# EAGLE design 0_3cbrd (EAGLE 7.6.0)
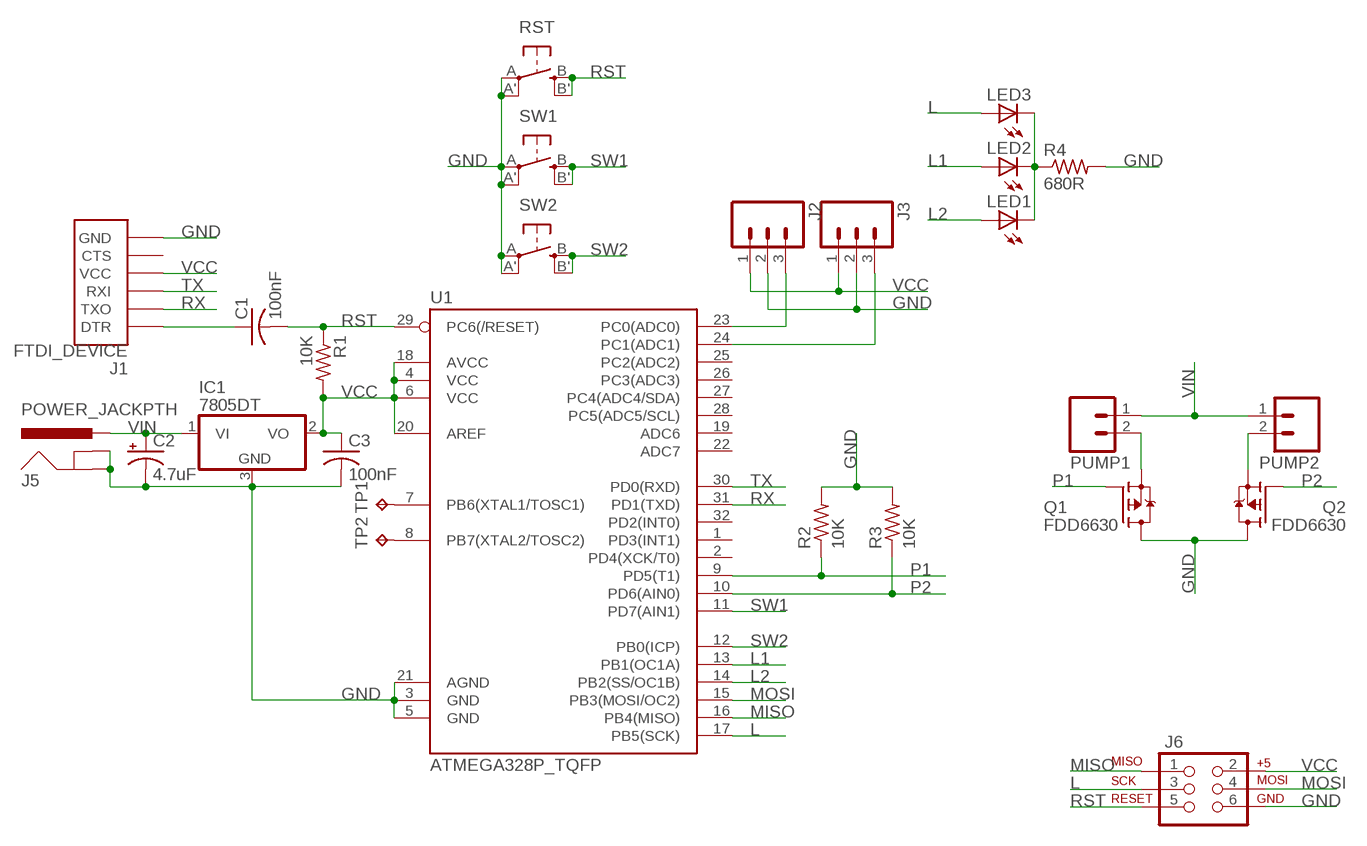
[diagram p0: schematic, sheet 1]

## Parts
C1  100nF  C-USC1206K  [C1206K]
C2  4.7uF  CPOL-US153CLV-0405  [153CLV-0405]
C3  100nF  C-USC1206K  [C1206K]
IC1  7805DT  [TO252]
J1  FTDI_DEVICE  [FTDI_DEVICE_SIDE]
J2  M03PTH  [1X03]
J3  M03PTH  [1X03]
J5  POWER_JACKPTH  [POWER_JACK_PTH]
J6  AVR_SPI_PRG_6PTH  [2X3]
LED1  LED3MM  [LED3MM]
LED2  LED3MM  [LED3MM]
LED3  LED3MM  [LED3MM]
PUMP1  M02PTH  [1X02]
PUMP2  M02PTH  [1X02]
Q1  FDD6630  FDD4141TO252  [TO252]
Q2  FDD6630  FDD4141TO252  [TO252]
R1  10K  R-US_M0805  [M0805]
R2  10K  R-US_M0805  [M0805]
R3  10K  R-US_M0805  [M0805]
R4  680R  R-US_M0805  [M0805]
RST  SPST_TACT-EVQQ2  [EVQ-Q2]
SW1  SPST_TACT-EVQQ2  [EVQ-Q2]
SW2  SPST_TACT-EVQQ2  [EVQ-Q2]
TP1  TPTP15SQ  [TP15SQ]
TP2  TPTP15SQ  [TP15SQ]
U1  ATMEGA328P_TQFP  [TQFP32-08]

## Nets
GND: C2.- C3.2 IC1.3(GND) J1.P$6(GND) J2.2 J3.2 J5.GND J5.GNDBREAK J6.6 Q1.3(D) Q2.3(D) R2.2 R3.2 R4.2 RST.A'(P1) RST.A(P) SW1.A'(P1) SW1.A(P) SW2.A'(P1) SW2.A(P) U1.3(GND) U1.5(GND) U1.21(AGND)
L: J6.3 LED3.A U1.17(PB5(SCK))
L1: LED2.A U1.13(PB1(OC1A))
L2: LED1.A U1.14(PB2(SS/OC1B))
MISO: J6.1 U1.16(PB4(MISO))
MOSI: J6.4 U1.15(PB3(MOSI/OC2))
N$1: LED1.K(C) LED2.K(C) LED3.K(C) R4.1
N$2: TP1.TP U1.7(PB6(XTAL1/TOSC1))
N$3: PUMP1.2 Q1.2(S)
N$4: C1.1 J1.P$1(DTR)
N$5: TP2.TP U1.8(PB7(XTAL2/TOSC2))
N$9: J2.3 U1.23(PC0(ADC0))
N$10: J3.3 U1.24(PC1(ADC1))
N$25: PUMP2.2 Q2.2(S)
P1: Q1.1(G) R2.1 U1.9(PD5(T1))
P2: Q2.1(G) R3.1 U1.10(PD6(AIN0))
RST: C1.2 J6.5 R1.1 RST.B'(S1) RST.B(S) U1.29(PC6(/RESET))
RX: J1.P$2(TXO) U1.31(PD1(TXD))
SW1: SW1.B'(S1) SW1.B(S) U1.11(PD7(AIN1))
SW2: SW2.B'(S1) SW2.B(S) U1.12(PB0(ICP))
TX: J1.P$3(RXI) U1.30(PD0(RXD))
VCC: C3.1 IC1.2(VO) J1.P$4(VCC) J2.1 J3.1 J6.2 R1.2 U1.4(VCC) U1.6(VCC) U1.18(AVCC) U1.20(AREF)
VIN: C2.+ IC1.1(VI) J5.PWR PUMP1.1 PUMP2.1
Unconnected: J1.P$5(CTS) U1.1(PD3(INT1)) U1.2(PD4(XCK/T0)) U1.19(ADC6) U1.22(ADC7) U1.25(PC2(ADC2)) U1.26(PC3(ADC3)) U1.27(PC4(ADC4/SDA)) U1.28(PC5(ADC5/SCL)) U1.32(PD2(INT0))

## Library data of the parts
C1 = resistor:C-US: CAPACITOR, American symbol
C2 = rcl:CPOL-US: POLARIZED CAPACITOR, American symbol
C3 = rcl:C-US: CAPACITOR, American symbol
IC1 = linear:78*: Positive VOLTAGE REGULATOR Source: http://cache.national.com/ds/LM/LM78L05.pdf http://www.fairchildsemi.com/ds/LM/LM7805.pdf
J1 = SparkFun-Connectors:FTDI_DEVICE: Connector which mates to FTDI basic or FTDI cable.
J2 J3 = SparkFun-Connectors:M03: Header 3 Standard 3-pin 0.1" header. Use with straight break away headers (SKU : PRT-00116), right angle break away headers (PRT-00553), swiss pins (PRT-00743), machine pins (PRT-00117), and female headers (PRT-00115). Molex polarized connector foot print use with SKU : PRT-08232 with associated crimp pins and housings.
J5 = SparkFun-Connectors:POWER_JACK: Power Jack This is the standard 5.5mm barrel jack for power. The PTH is the most common, proven, reliable, footprint. The Slot footprint only works if the mill layer is transmitted to the PCB fab house so be warned. Mating wall wart : TOL-00298 (and others); PROD_ID: CONN-08197
J6 = SparkFun-Connectors:AVR_SPI_PRG_6: AVR ISP 6 Pin This is the reduced ISP connector for AVR programming. Common on Arduino. This footprint will take up less PCB space and can be used with a 10-pin to 6-pin adapter such as SKU: BOB-08508 **Special note about "TEST_POINT" package. The stop mask is on the top side, so if you want your programming test points to be on the bottom of your board, make sure to place this package on the bottom side of the board. This also ensure that the orientation to program from the bottom side will be correct.
LED1-LED3 = led:LED: LED OSRAM: - CHIPLED LG R971, LG N971, LY N971, LG Q971, LY Q971, LO R971, LY R971 LH N974, LH R974 LS Q976, LO Q976, LY Q976 LO Q996 - Hyper CHIPLED LW Q18S LB Q993, LB Q99A, LB R99A - SideLED LS A670, LO A670, LY A670, LG A670, LP A670 LB A673, LV A673, LT A673, LW A673 LH A674 LY A675 LS A676, LA A676, LO A676, LY A676, LW A676 LS A679, LY A679, LG A679 - Hyper Micro SIDELED® LS Y876, LA Y876, LO Y876, LY Y876 LT Y87S - SmartLED LW L88C, LW L88S LB L89C, LB L89S, LG L890 LS L89K, LO L89K, LY L89K LS L896, LA L896, LO L896, LY L896 - TOPLED LS T670, LO T670, LY T670, LG T670, LP T670 LSG T670, LSP T670, LSY T670, LOP T670, LYG T670 LG T671, LOG T671, LSG T671 LB T673, LV T673, LT T673, LW T673 LH T674 LS T676, LA T676, LO T676, LY T676, LB T676, LH T676, LSB T676, LW T676 LB T67C, LV T67C, LT T67C, LS T67K, LO T67K, LY T67K, LW E67C LS E67B, LA E67B, LO E67B, LY E67B, LB E67C, LV E67C, LT E67C LW T67C LS T679, LY T679, LG T679 LS T770, LO T770, LY T770, LG T770, LP T770 LB T773, LV T773, LT T773, LW T773 LH T774 LS E675, LA E675, LY E675, LS T675 LS T776, LA T776, LO T776, LY T776, LB T776 LHGB T686 LT T68C, LB T68C - Hyper Mini TOPLED® LB M676 - Mini TOPLED Santana® LG M470 LS M47K, LO M47K, LY M47K Source: http://www.osram.convergy.de LUXEON: - LUMILED® LXK2-PW12-R00, LXK2-PW12-S00, LXK2-PW14-U00, LXK2-PW14-V00 LXK2-PM12-R00, LXK2-PM12-S00, LXK2-PM14-U00 LXK2-PE12-Q00, LXK2-PE12-R00, LXK2-PE12-S00, LXK2-PE14-T00, LXK2-PE14-U00 LXK2-PB12-K00, LXK2-PB12-L00, LXK2-PB12-M00, LXK2-PB14-N00, LXK2-PB14-P00, LXK2-PB14-Q00 LXK2-PR12-L00, LXK2-PR12-M00, LXK2-PR14-Q00, LXK2-PR14-R00 LXK2-PD12-Q00, LXK2-PD12-R00, LXK2-PD12-S00 LXK2-PH12-R00, LXK2-PH12-S00 LXK2-PL12-P00, LXK2-PL12-Q00, LXK2-PL12-R00 Source: www.luxeon.com KINGBRIGHT: KA-3528ASYC Source: www.kingbright.com
PUMP1 PUMP2 = SparkFun-Connectors:M02: Standard 2-pin 0.1" header. Use with - straight break away headers ( PRT-00116) - right angle break away headers (PRT-00553) - swiss pins (PRT-00743) - machine pins (PRT-00117) - female headers (PRT-00115) Molex polarized connector foot print use with: PRT-08233 with associated crimp pins and housings. 2.54_SCREWTERM for use with PRT-10571. 3.5mm Screw Terminal footprints for PRT-08084 5mm Screw Terminal footprints for use with PRT-08432
Q1 Q2 = transistor-fet:FDD4141: P-Channel PowerTrench® MOSFET Source: FDD4141.pdf
R1-R4 = resistor:R-US_: RESISTOR, American symbol
RST SW1 SW2 = adafruit:SPST_TACT: SMT 6mm switch, EVQQ2 series http://www.ladyada.net/library/eagle
TP1 TP2 = testpad:TP: Test pad
U1 = SparkFun-DigitalIC:ATMEGA328P_TQFP; PROD_ID: IC-09069

## Board
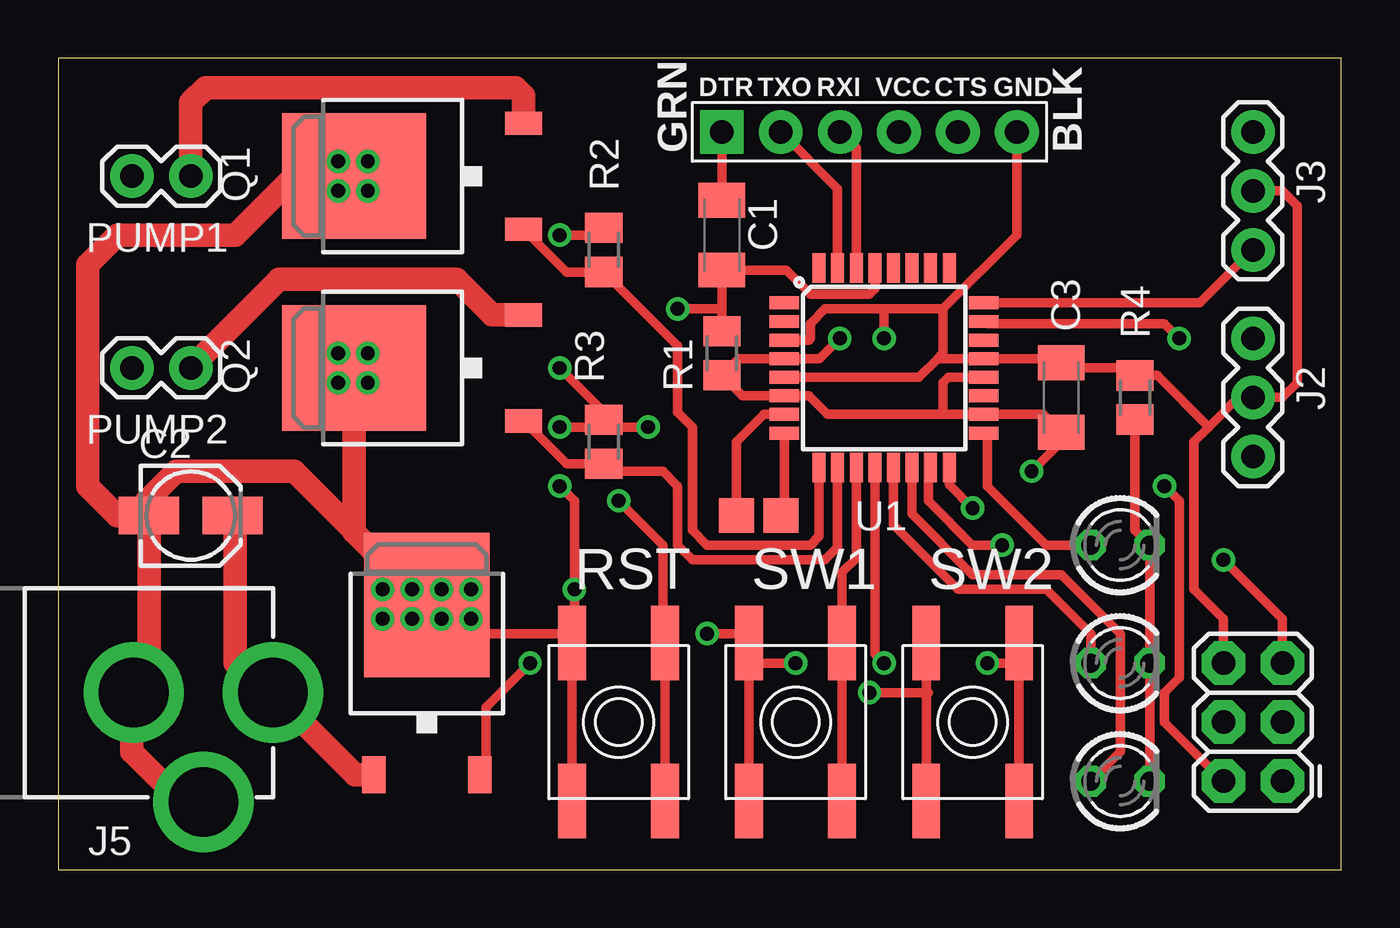
[diagram p1: board, top side]
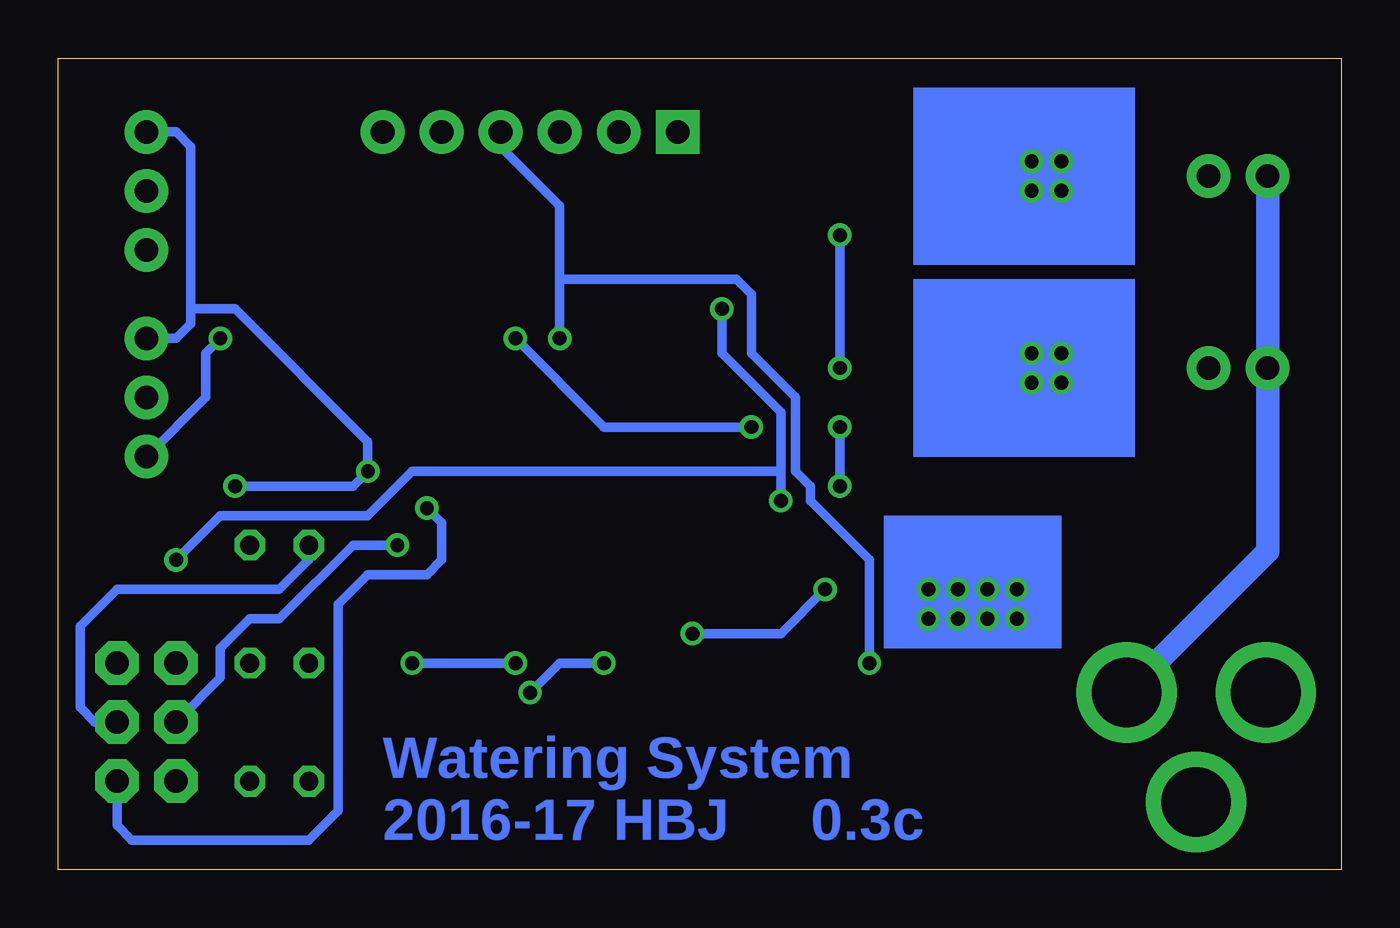
[diagram p2: board, bottom side, seen from below]

Size 55.24 x 34.92 mm. Coordinates in mm from the lower left corner, seen from the top.
Outline: 0,34.91 0,0 55.24,0 55.24,34.92 0,34.92
Copper layers (1*16): Top 0.035mm / dielectric 1.5mm / Bottom 0.035mm
Design rules "oshpark": minimum track width 16mil, minimum drill 13mil, track to track 8mil, track to pad 8mil, pad to pad 8mil, via to via 8mil, smd to smd 8mil, copper to edge 18mil, drill to drill 8mil, minimum pad ring 10mil, minimum via ring 8mil, stop-mask expansion 4mil, vias tented up to drill 0mil, thermal gap 10mil

### Footprints (pad centres in the part's own frame; a part is rotated, then mirrored left to right if it is on the bottom)
C1206K = smd 1.5 x 2: 1 -1.5,0; 2 1.5,0
153CLV-0405 = smd 2.6 x 1.6: + 1.8,0; - -1.8,0
TO252 = smd 1 x 1.6: 1 -2.28,-4.8; 2 2.28,-4.8 | smd 5.4 x 6.2: 3 0,2.5
FTDI_DEVICE_SIDE = drill 1.016 pad 1.88 square: P$1 -6.35,0 | drill 1.016 pad 1.88: P$2 -3.81,0; P$3 -1.27,0; P$4 1.27,0; P$5 3.81,0; P$6 6.35,0
1X03 = drill 1.016 pad 1.88: 1 0,0; 2 2.54,0; 3 5.08,0
POWER_JACK_PTH = drill 2.997 pad 4.318: GND 0,7.7; GNDBREAK 4.7,10.7; PWR 0,13.7
2X3 = drill 1.016 pad 1.88 octagon: 1 0,0; 2 0,2.54; 3 2.54,0; 4 2.54,2.54; 5 5.08,0; 6 5.08,2.54
LED3MM = drill 0.813 octagon: A -1.27,0; K 1.27,0
1X02 = drill 1.016 pad 1.88: 1 0,0; 2 2.54,0
M0805 = smd 1.3 x 1.6: 1 -0.95,0; 2 0.95,0
EVQ-Q2 = smd 3.2 x 1.2: A -3.4,-2; A' 3.4,-2; B -3.4,2; B' 3.4,2
TP15SQ = smd 1.5 x 1.5: TP 0,0
TQFP32-08 = smd 1.27 x 0.559: 1 -4.293,2.8; 2 -4.293,2; 3 -4.293,1.2; 4 -4.293,0.4; 5 -4.293,-0.4; 6 -4.293,-1.2; 7 -4.293,-2; 8 -4.293,-2.8; 17 4.293,-2.8; 18 4.293,-2; 19 4.293,-1.2; 20 4.293,-0.4; 21 4.293,0.4; 22 4.293,1.2; 23 4.293,2; 24 4.293,2.8 | smd 0.559 x 1.27: 9 -2.8,-4.293; 10 -2,-4.293; 11 -1.2,-4.293; 12 -0.4,-4.293; 13 0.4,-4.293; 14 1.2,-4.293; 15 2,-4.293; 16 2.8,-4.293; 25 2.8,4.293; 26 2,4.293; 27 1.2,4.293; 28 0.4,4.293; 29 -0.4,4.293; 30 -1.2,4.293; 31 -2,4.293; 32 -2.8,4.293

### Placement (x,y rotation side)
C1  28.58,27.3 270 top
C2  5.71,15.24 0 top
C3  43.18,20.32 90 top
IC1  15.88,8.89 0 top
J1  34.92,31.75 0 top
J2  51.44,22.86 270 top
J3  51.44,31.75 270 top
J5  -4.44,7.62 270 top
J6  52.71,3.81 90 top
LED1  45.72,3.81 0 top
LED2  45.72,8.89 0 top
LED3  45.72,13.97 0 top
PUMP1  3.18,29.84 0 top
PUMP2  3.18,21.59 0 top
Q1  15.24,29.84 90 top
Q2  15.24,21.59 90 top
R1  28.58,22.23 270 top
R2  23.49,26.67 90 top
R3  23.49,18.41 90 top
R4  46.35,20.32 90 top
RST  24.13,6.35 270 top
SW1  31.75,6.35 270 top
SW2  39.37,6.35 270 top
TP1  29.21,15.24 0 top
TP2  31.12,15.24 0 top
U1  35.56,21.59 0 top

### Tracks (layer width: path | path; a pad name or v marks a point on that pad's centre or on a via)
GND  (via drill 0.6)
  Top 0.406: J6.6 50.16,10.79 48.9,12.06 48.9,18.41 49.53,19.05 | 49.53,19.05 50.8,20.32 J2.2 52.71,20.32 53.34,20.95 53.34,28.57 52.71,29.21 J3.2 | 37.87,21.99 U1.21 43.01,21.99 C3.2 43.18,21.59 46.35,21.59 R4.2 47.31,21.27 49.53,19.05 | J1.P$6 41.27,27.3 38.1,24.13 | 37.87,21.99 38.1,22.23 38.1,24.13 | SW2.A 37.37,7.62 | 37.37,7.62 SW2.A' | SW1.A SW1.A' | RST.A' RST.A 22.23,10.16 | v21.59,27.3 23.49,27.3 R2.2 | v21.59,21.59 23.49,19.69 R3.2 23.49,19.05 | U1.5 37.06,21.19 37.87,21.99 | U1.3 32.31,22.79 32.38,22.86 32.38,23.49 33.02,24.13 35.56,24.13 | 35.56,24.13 38.1,24.13 | 22.23,10.16 v22.23,12.06 22.23,15.88 v21.59,16.51 | 23.49,19.05 v21.59,19.05 | 23.49,19.05 v25.4,19.05 | v35.56,22.86 35.56,24.13 | 22.23,10.16 17.11,10.16 IC1.3 | v27.94,10.16 29.21,10.16 SW1.A | v31.75,8.89 29.84,8.89 SW1.A | 37.37,7.62 v34.92,7.62 | 37.47,7.62 37.37,7.62
  Top 1.016: Q2.3 12.74,14.56 | IC1.3 12.74,14.52 12.74,14.56 | C2.- 3.92,8.28 J5.GND 3.18,7.54 3.18,5.08 5.34,2.92 J5.GNDBREAK | 12.74,14.56 10.16,17.14 5.08,17.14 3.81,15.88 3.81,15.34 C2.- | Q1.3 10.16,29.84 7.62,27.3 2.54,27.3 1.27,26.03 1.27,16.51 2.54,15.24 C2.-
  Bottom 0.406: v21.59,21.59 v21.59,27.3 | v21.59,19.05 v21.59,16.51 | v35.56,22.86 31.75,19.05 v25.4,19.05 | v27.94,10.16 24.13,10.16 v22.23,12.06 | v31.75,8.89 33.66,8.89 v34.92,7.62
L
  Top 0.406: LED3.A 42.55,13.97 40.01,16.51 40.01,18.64 U1.17
  Bottom 0.406: LED3.A 44.45,13.33 45.72,12.06 52.71,12.06 54.29,10.48 54.29,6.98 53.66,6.35 J6.3
L1
  Top 0.406: LED2.A 44.45,10.16 42.55,12.06 38.73,12.06 35.96,14.84 U1.13
L2
  Top 0.406: LED1.A 45.72,5.08 45.72,10.16 43.18,12.7 39.37,12.7 36.76,15.31 U1.14
MISO  (via drill 0.6)
  Top 0.406: U1.16 38.36,16.57 v39.37,15.56
  Bottom 0.406: J6.1 52.71,1.9 52.07,1.27 44.45,1.27 43.18,2.54 43.18,11.43 41.91,12.7 39.37,12.7 38.73,13.33 38.73,14.92 v39.37,15.56
MOSI  (via drill 0.6)
  Top 0.406: v40.64,13.97 39.37,13.97 37.47,15.88 37.47,17.14 U1.15
  Bottom 0.406: v40.64,13.97 42.55,13.97 45.72,10.79 46.99,10.79 48.26,9.52 48.26,8.25 J6.4
N$1
  Top 0.406: LED1.K LED2.K LED3.K 46.35,14.6 R4.1
N$2
  Top 0.406: TP1.TP 29.21,18.41 30.38,19.59 U1.7
N$3
  Top 1.016: Q1.2 20.04,33.3 19.68,33.66 6.35,33.66 5.71,33.02 PUMP1.2
N$4
  Top 0.406: C1.1 J1.P$1
N$5
  Top 0.406: U1.8 31.27,15.39 TP2.TP
N$7  (via drill 0.6)
  other vias: 12.07,29.21
N$8  (via drill 0.6)
  other vias: 12.07,30.48
N$9  (via drill 0.6)
  Top 0.406: v48.26,22.86 47.62,23.49 40.01,23.49 U1.23
  Bottom 0.406: v48.26,22.86 48.9,22.23 48.9,20.32 J2.3
N$10
  Top 0.406: U1.24 49.16,24.39 J3.3
N$11  (via drill 0.6)
  other vias: 13.34,30.48
N$12  (via drill 0.6)
  other vias: 13.34,29.21
N$13  (via drill 0.6)
  other vias: 12.07,22.23
N$14  (via drill 0.6)
  other vias: 13.34,22.23
N$15  (via drill 0.6)
  other vias: 13.34,20.95
N$16  (via drill 0.6)
  other vias: 12.07,20.95
N$17  (via drill 0.6)
  other vias: 15.24,12.06
N$18  (via drill 0.6)
  other vias: 16.51,12.06
N$19  (via drill 0.6)
  other vias: 16.51,10.79
N$20  (via drill 0.6)
  other vias: 15.24,10.79
N$21  (via drill 0.6)
  other vias: 13.97,10.79
N$22  (via drill 0.6)
  other vias: 13.97,12.06
N$23  (via drill 0.6)
  other vias: 17.78,12.06
N$24  (via drill 0.6)
  other vias: 17.78,10.79
N$25
  Top 1.016: Q2.2 18.68,23.87 17.14,25.4 9.52,25.4 PUMP2.2
P1
  Top 0.406: U1.9 32.76,14.34 32.38,13.97 27.94,13.97 27.3,14.6 27.3,19.05 26.67,19.69 26.67,22.55 R2.1 21.88,25.72 Q1.1
P2
  Top 0.406: U1.10 33.56,13.88 33.02,13.33 27.3,13.33 26.67,13.97 26.67,16.51 26.04,17.14 23.81,17.14 R3.1 21.88,17.46 Q2.1
RST  (via drill 0.6)
  Top 0.406: U1.29 35.16,25 34.92,24.77 32.38,24.77 31.34,25.8 C1.2 28.58,24.13 | RST.B' RST.B 26.04,10.16 26.04,13.97 v24.13,15.88 | R1.1 28.58,24.13 | v26.67,24.13 28.58,24.13 | v50.16,13.33 52.71,10.79 J6.5
  Bottom 0.406: v26.67,24.13 26.67,22.23 24.13,19.69 24.13,17.14 | v24.13,15.88 24.13,17.14 | v50.16,13.33 48.26,15.24 41.91,15.24 40.01,17.14 24.13,17.14
RX
  Top 0.406: U1.31 33.56,29.3 J1.P$2
SW1
  Top 0.406: U1.11 34.36,13.4 33.75,12.79 SW1.B SW1.B'
SW2  (via drill 0.6)
  Top 0.406: SW2.B' SW2.B 41.27,8.89 v40.01,8.89 | U1.12 35.16,9.29 v35.56,8.89
  Bottom 0.406: v40.01,8.89 v35.56,8.89
TX
  Top 0.406: U1.30 34.36,31.05 J1.P$3
VCC  (via drill 0.6)
  Top 0.406: v33.66,22.86 32.79,21.99 U1.4 29.29,21.99 R1.2 29.46,20.39 U1.6 32.31,20.39 33.12,19.59 38.1,19.59 | 38.1,19.59 U1.18 42.41,19.59 C3.1 43.18,18.41 v41.91,17.14 | U1.20 38.34,21.19 38.1,20.95 38.1,19.59 | v47.62,16.51 48.26,15.88 48.26,8.25 47.62,7.62 47.62,6.35 J6.2 | v20.32,8.89 18.41,6.98 18.41,4.45 IC1.2
  Bottom 0.406: 49.53,24.13 49.53,23.49 50.16,22.86 J2.1 | 49.53,24.13 49.53,31.12 50.16,31.75 J3.1 | 33.66,25.4 33.66,28.57 36.2,31.12 J1.P$4 | 33.66,25.4 v33.66,22.86 | 49.53,24.13 47.62,24.13 41.91,18.41 v41.91,17.14 42.55,16.51 v47.62,16.51 | v20.32,8.89 20.32,13.33 22.86,15.88 22.86,16.51 23.49,17.14 23.49,20.32 25.4,22.23 25.4,24.77 26.04,25.4 33.66,25.4
VIN
  Top 1.016: C2.+ 7.62,15.13 7.62,8.89 8.89,7.62 J5.PWR 12.79,4.09 IC1.1
  Bottom 1.016: J5.PWR 3.18,13.7 PUMP2.1 PUMP1.1
(copper drawn outside any net)
  shapes: Bottom area x4

### Text on the board
Bottom: 0.3c | Watering System / 2016-17 HBJ
tNames: RST | SW1 | SW2
bStop: 0.3c | Watering System / 2016-17 HBJ